# Altium project ArcadeJoystick.PrjPCB
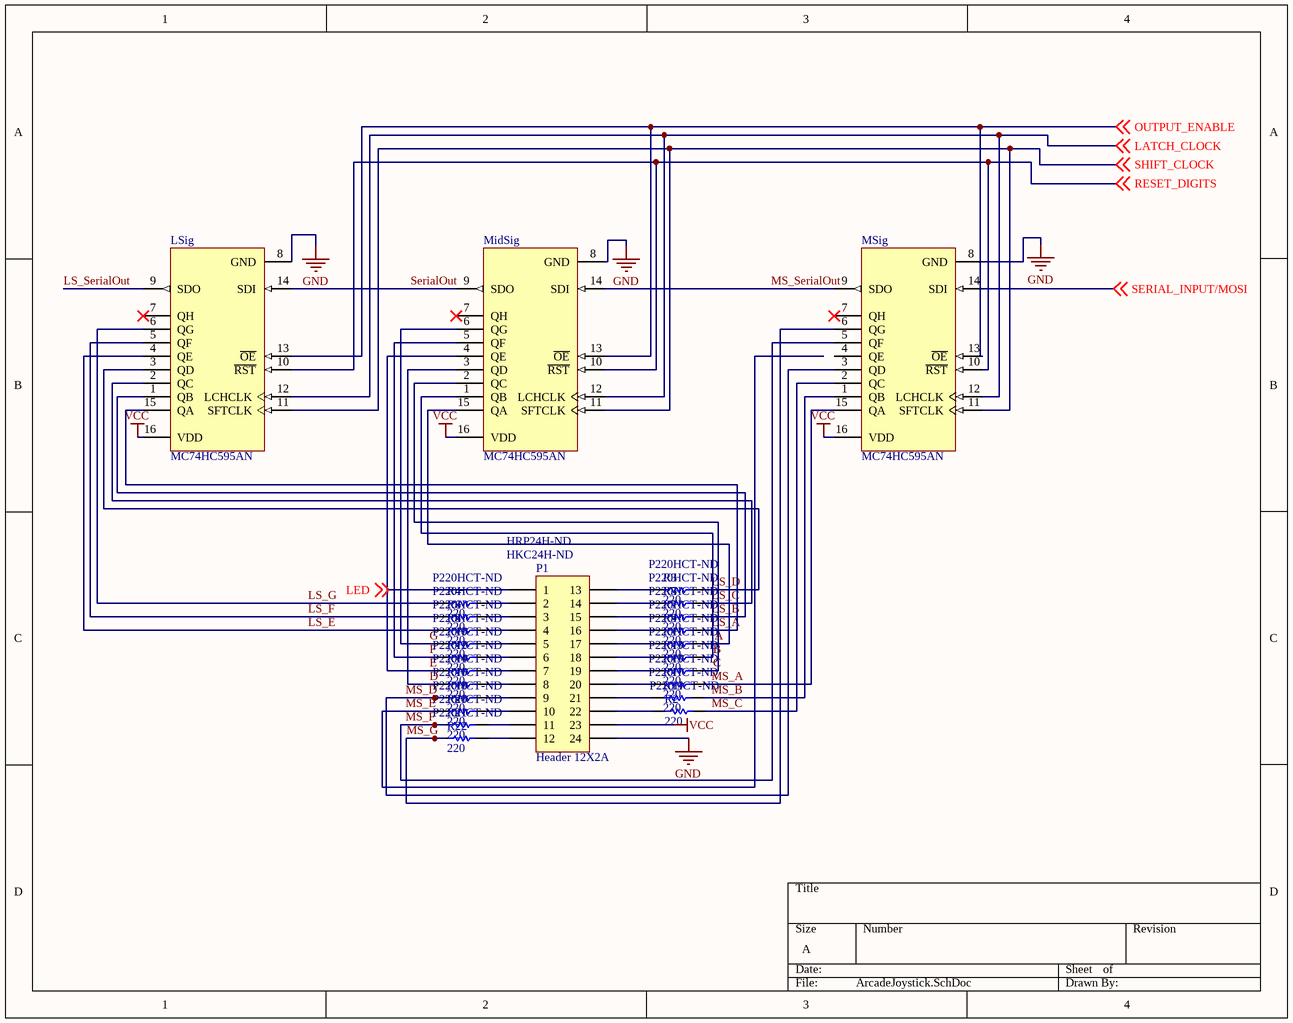
[diagram p0: ArcadeJoystick.SchDoc]
2 sheets, 52 parts. Net scope: global (net labels, ports and power ports of the same name join across sheets).
Board file: ArcadeJoystick.PcbDoc
Sheets:
  ArcadeJoystick.SchDoc
  Teensy.SchDoc

## Sheet ArcadeJoystick.SchDoc
size A

### Parts
LSig  MC74HC595AN  [648-08]
MidSig  MC74HC595AN  [648-08]
MSig  MC74HC595AN  [648-08]
P1  Header 12X2A  Supplier Part Number 1: HKC24H-ND  Supplier Part Number 2: HRP24H-ND  [HDR2X12_CEN]
R2  value 220  Supplier Part Number 1: P220HCT-ND  [1608[0603]]  (hidden comment: Res Semi)
R3  value 220  Supplier Part Number 1: P220HCT-ND  [1608[0603]]  (hidden comment: Res Semi)
R4  value 220  Supplier Part Number 1: P220HCT-ND  [1608[0603]]  (hidden comment: Res Semi)
R5  value 220  Supplier Part Number 1: P220HCT-ND  [1608[0603]]  (hidden comment: Res Semi)
R6  value 220  Supplier Part Number 1: P220HCT-ND  [1608[0603]]  (hidden comment: Res Semi)
R7  value 220  Supplier Part Number 1: P220HCT-ND  [1608[0603]]  (hidden comment: Res Semi)
R8  value 220  Supplier Part Number 1: P220HCT-ND  [1608[0603]]  (hidden comment: Res Semi)
R9  value 220  Supplier Part Number 1: P220HCT-ND  [1608[0603]]  (hidden comment: Res Semi)
R10  value 220  Supplier Part Number 1: P220HCT-ND  [1608[0603]]  (hidden comment: Res Semi)
R11  value 220  Supplier Part Number 1: P220HCT-ND  [1608[0603]]  (hidden comment: Res Semi)
R12  value 220  Supplier Part Number 1: P220HCT-ND  [1608[0603]]  (hidden comment: Res Semi)
R13  value 220  Supplier Part Number 1: P220HCT-ND  [1608[0603]]  (hidden comment: Res Semi)
R14  value 220  Supplier Part Number 1: P220HCT-ND  [1608[0603]]  (hidden comment: Res Semi)
R15  value 220  Supplier Part Number 1: P220HCT-ND  [1608[0603]]  (hidden comment: Res Semi)
R16  value 220  Supplier Part Number 1: P220HCT-ND  [1608[0603]]  (hidden comment: Res Semi)
R17  value 220  Supplier Part Number 1: P220HCT-ND  [1608[0603]]  (hidden comment: Res Semi)
R18  value 220  Supplier Part Number 1: P220HCT-ND  [1608[0603]]  (hidden comment: Res Semi)
R19  value 220  Supplier Part Number 1: P220HCT-ND  [1608[0603]]  (hidden comment: Res Semi)
R20  value 220  Supplier Part Number 1: P220HCT-ND  [1608[0603]]  (hidden comment: Res Semi)
R21  value 220  Supplier Part Number 1: P220HCT-ND  [1608[0603]]  (hidden comment: Res Semi)
R22  value 220  Supplier Part Number 1: P220HCT-ND  [1608[0603]]  (hidden comment: Res Semi)

### Nets
GND: LSig.8(GND) MidSig.8(GND) MSig.8(GND) P1.24
VCC: LSig.16(VDD) MidSig.16(VDD) MSig.16(VDD) P1.23
A: MidSig.15(QA) R11.2
B: MidSig.1(QB) R13.2
C: MidSig.2(QC) R15.2
D: MidSig.3(QD) R16.1
E: MidSig.4(QE) R14.1
F: MidSig.5(QF) R12.1
G: MidSig.6(QG) R10.1
LATCH_CLOCK: LSig.12(LCHCLK) MidSig.12(LCHCLK) MSig.12(LCHCLK) ; off-sheet LATCH_CLOCK
LED: P1.1 ; off-sheet LED
LS_A: LSig.15(QA) R9.2
LS_B: LSig.1(QB) R7.2
LS_C: LSig.2(QC) R5.2
LS_D: LSig.3(QD) R3.2
LS_E: LSig.4(QE) R8.1
LS_F: LSig.5(QF) R6.1
LS_G: LSig.6(QG) R4.1
LS_SerialOut: LSig.9(SDO)
MS_A: MSig.15(QA) R17.2
MS_B: MSig.1(QB) R19.2
MS_C: MSig.2(QC) R2.2
MS_D: MSig.3(QD) R18.1
MS_E: R20.1
MS_F: MSig.5(QF) R21.1
MS_G: MSig.6(QG) R22.1
MS_SerialOut: MidSig.14(SDI) MSig.9(SDO)
OUTPUT_ENABLE: LSig.13(~{OE}) MidSig.13(~{OE}) MSig.13(~{OE}) ; off-sheet OUTPUT_ENABLE
RESET_DIGITS: LSig.10(~{RST}) MidSig.10(~{RST}) MSig.10(~{RST}) ; off-sheet RESET_DIGITS
SERIAL_INPUT/MOSI: MSig.14(SDI) ; off-sheet SERIAL_INPUT/MOSI  [project net MOSI]
SerialOut: LSig.14(SDI) MidSig.9(SDO)
SHIFT_CLOCK: LSig.11(SFTCLK) MidSig.11(SFTCLK) MSig.11(SFTCLK) ; off-sheet SHIFT_CLOCK  [project net SCLK]
NetP1_2: P1.2 R4.2
NetP1_3: P1.3 R6.2
NetP1_4: P1.4 R8.2
NetP1_5: P1.5 R10.2
NetP1_6: P1.6 R12.2
NetP1_7: P1.7 R14.2
NetP1_8: P1.8 R16.2
NetP1_9: P1.9 R18.2
NetP1_10: P1.10 R20.2
NetP1_11: P1.11 R21.2
NetP1_12: P1.12 R22.2
NetP1_13: P1.13 R3.1
NetP1_14: P1.14 R5.1
NetP1_15: P1.15 R7.1
NetP1_16: P1.16 R9.1
NetP1_17: P1.17 R11.1
NetP1_18: P1.18 R13.1
NetP1_19: P1.19 R15.1
NetP1_20: P1.20 R17.1
NetP1_21: P1.21 R19.1
NetP1_22: P1.22 R2.1

Not connected (* = marked no-connect by the designer): LSig 7(QH)*; MidSig 7(QH)*; MSig 4(QE) 7(QH)*

### Library data of the parts
LSig MidSig MSig = MC74HC595AN: 8-Bit Serial-Input/Serial or Prallel-Output Shift Register with Latched 3-State Outputs; Published: 15-Apr-2002; DatasheetVersion: Mar-2000; PackageVersion: Apr-2000; PackageReference: 648-08; Publisher: Altium Limited; PackageDescription: DIP; 16 Leads; Row Spacing 7.62 mm; Pitch 2.54 mm; Code_JEDEC: MS-001-BB; ComponentLink1Description: Manufacturer Link; ComponentLink1URL: http://www.onsemi.com/; ComponentLink2Description: Datasheet; ComponentLink2URL: http://www.onsemi.com/pub/Collateral/MC74HC595A-D.PDF
P1 = Header 12X2A: Header, 12-Pin, Dual row; LatestRevisionDate: 17-Jul-2002; LatestRevisionNote: Re-released for DXP Platform.; Publisher: Altium Limited; Supplier 1: Digi-Key; Supplier 2: Digi-Key
R2-R22 = Res Semi: Semiconductor Resistor; Published: 8-Jun-2000; LatestRevisionDate: 17-Jul-2002; LatestRevisionNote: Re-released for DXP Platform.; PackageReference: AXIAL-0.5; Publisher: Altium Limited; PackageDescription: Axial Device, Thru-Hole; 2 Leads; 0.5 in Pin Spacing; Supplier 1: Digi-Key

## Sheet Teensy.SchDoc
size A
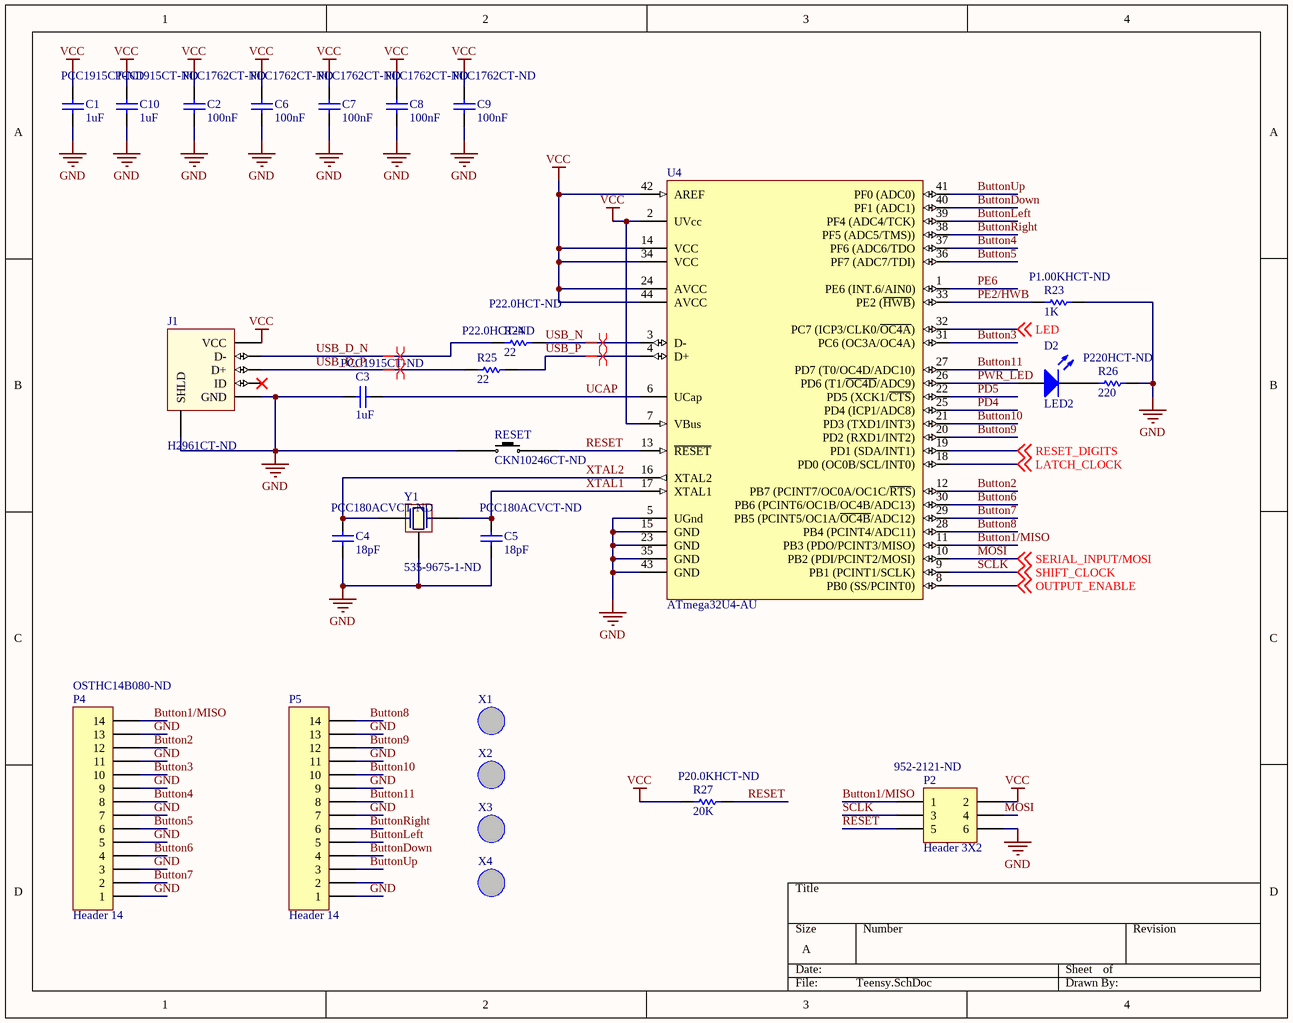
[diagram p1: Teensy.SchDoc]

### Parts
C1  value 1uF  Supplier Part Number 1: PCC1915CT-ND  [1608[0603]]  (hidden comment: Cap Semi)
C2  value 100nF  Supplier Part Number 1: PCC1762CT-ND  [1608[0603]]  (hidden comment: Cap Semi)
C3  value 1uF  Supplier Part Number 1: PCC1915CT-ND  [1608[0603]]  (hidden comment: Cap Semi)
C4  value 18pF  Supplier Part Number 1: PCC180ACVCT-ND  [1608[0603]]  (hidden comment: Cap Semi)
C5  value 18pF  Supplier Part Number 1: PCC180ACVCT-ND  [1608[0603]]  (hidden comment: Cap Semi)
C6  value 100nF  Supplier Part Number 1: PCC1762CT-ND  [1608[0603]]  (hidden comment: Cap Semi)
C7  value 100nF  Supplier Part Number 1: PCC1762CT-ND  [1608[0603]]  (hidden comment: Cap Semi)
C8  value 100nF  Supplier Part Number 1: PCC1762CT-ND  [1608[0603]]  (hidden comment: Cap Semi)
C9  value 100nF  Supplier Part Number 1: PCC1762CT-ND  [1608[0603]]  (hidden comment: Cap Semi)
C10  value 1uF  Supplier Part Number 1: PCC1915CT-ND  [1608[0603]]  (hidden comment: Cap Semi)
D2  LED2  [INDC1608L]
J1  Supplier Part Number 1: H2961CT-ND  [UX60A-MB-5ST]  (hidden comment: UX60A-MB-5ST)
P2  Header 3X2  Supplier Part Number 1: 952-2121-ND  [HDR2X3]
P4  Header 14  Supplier Part Number 1: OSTHC14B080-ND  [PTSA 0,5/14-2,5-Z]
P5  Header 14  [PTSA 0,5/14-2,5-Z]
R23  value 1K  Supplier Part Number 1: P1.00KHCT-ND  [1608[0603]]  (hidden comment: Res Semi)
R24  value 22  Supplier Part Number 1: P22.0HCT-ND  [1608[0603]]  (hidden comment: Res Semi)
R25  value 22  Supplier Part Number 1: P22.0HCT-ND  [1608[0603]]  (hidden comment: Res Semi)
R26  value 220  Supplier Part Number 1: P220HCT-ND  [1608[0603]]  (hidden comment: Res Semi)
R27  value 20K  Supplier Part Number 1: P20.0KHCT-ND  [1608[0603]]  (hidden comment: Res Semi)
RESET  Supplier Part Number 1: CKN10246CT-ND  [KMR231NGLFS]  (hidden comment: KMR231NGLFS)
U4  ATmega32U4-AU  [44ML_N]
X1  4-40 Hole  [4-40 Hole]  (value not drawn)
X2  4-40 Hole  [4-40 Hole]  (value not drawn)
X3  4-40 Hole  [4-40 Hole]  (value not drawn)
X4  4-40 Hole  [4-40 Hole]  (value not drawn)
Y1  Supplier Part Number 1: 535-9675-1-ND  [ABM8-16.000MHZ-10-1-U-T]  (hidden comment: ABM8-16.000MHZ-10-1-U-T)

### Nets
GND: C1.1 C2.2 C3.2 C4.1 C5.1 C6.2 C7.2 C8.2 C9.2 C10.1 J1.0(SHLD) J1.5(GND) P2.6 P4.1 P4.3 P4.5 P4.7 P4.9 P4.11 P4.13 P5.1 P5.7 P5.9 P5.11 P5.13 R23.2 R26.1 RESET.1 U4.5(UGnd) U4.15(GND) U4.23(GND) U4.35(GND) U4.43(GND) Y1.0(GND)
VCC: C1.2 C2.1 C6.1 C7.1 C8.1 C9.1 C10.2 J1.1(VCC) P2.2 R27.1 U4.2(UVcc) U4.7(VBus) U4.14(VCC) U4.24(AVCC) U4.34(VCC) U4.42(AREF) U4.44(AVCC)
Button1/MISO: P2.1 P4.14 U4.11(PB3_(PDO/PCINT3/MISO))
Button2: P4.12 U4.12(PB7_(PCINT7/OC0A/OC1C/~{RTS}))
Button3: P4.10 U4.31(PC6_(OC3A/OC4A))
Button4: P4.8 U4.37(PF6_(ADC6/TDO)
Button5: P4.6 U4.36(PF7_(ADC7/TDI))
Button6: P4.4 U4.30(PB6_(PCINT6/OC1B/OC4B/ADC13))
Button7: P4.2 U4.29(PB5_(PCINT5/OC1A/~{OC4B}/ADC12))
Button8: P5.14 U4.28(PB4_(PCINT4/ADC11))
Button9: P5.12 U4.20(PD2_(RXD1/INT2))
Button10: P5.10 U4.21(PD3_(TXD1/INT3))
Button11: P5.8 U4.27(PD7_(T0/OC4D/ADC10))
ButtonDown: P5.4 U4.40(PF1_(ADC1))
ButtonLeft: P5.5 U4.39(PF4_(ADC4/TCK))
ButtonRight: P5.6 U4.38(PF5_(ADC5/TMS)))
ButtonUp: P5.3 U4.41(PF0_(ADC0))
LATCH_CLOCK: U4.18(PD0_(OC0B/SCL/INT0)) ; off-sheet LATCH_CLOCK
LED: U4.32(PC7_(ICP3/CLK0/~{OC4A})) ; off-sheet LED
MOSI: P2.4 U4.10(PB2_(PDI/PCINT2/MOSI)) ; off-sheet SERIAL_INPUT/MOSI  [also labelled SERIAL_INPUT/MOSI]
OUTPUT_ENABLE: U4.8(PB0_(SS/PCINT0)) ; off-sheet OUTPUT_ENABLE
PD4: U4.25(PD4_(ICP1/ADC8))
PD5: U4.22(PD5_(XCK1/~{CTS}))
PE2/HWB: R23.1 U4.33(PE2_(~{HWB}))
PE6: U4.1(PE6_(INT.6/AIN0))
PWR_LED: D2.1(A) U4.26(PD6_(T1/~{OC4D}/ADC9))
RESET: P2.5 R27.2 RESET.2 U4.13(~{RESET})
RESET_DIGITS: U4.19(PD1_(SDA/INT1)) ; off-sheet RESET_DIGITS
SCLK: P2.3 U4.9(PB1_(PCINT1/SCLK)) ; off-sheet SHIFT_CLOCK  [also labelled SHIFT_CLOCK]
UCAP: C3.1 U4.6(UCap)
USB_D_N: J1.2(D-) R24.1
USB_D_P: J1.3(D+) R25.1
USB_N: R24.2 U4.3(D-)
USB_P: R25.2 U4.4(D+)
XTAL1: C5.2 U4.17(XTAL1) Y1.4
XTAL2: C4.2 U4.16(XTAL2) Y1.2
NetD2_2: D2.2(K) R26.2

Not connected (* = marked no-connect by the designer): J1 4(ID)*; P5 2

### Layout directives
differential pair: USB_D_N, USB_D_P, USB_N, USB_P

### Library data of the parts
C1-C10 = Cap Semi: Capacitor (Semiconductor SIM Model); Published: 8-Jun-2000; LatestRevisionDate: 29-May-2009; LatestRevisionNote: IPC-7351 Footprint Added.; PackageReference: C1206; Publisher: Altium Limited; PackageDescription: Chip Capacitor; Supplier 1: Digi-Key
D2 = LED2: 475-2816-1-ND; Published: 8-Jun-2000; LatestRevisionDate: 17-Jul-2002; LatestRevisionNote: Re-released for DXP Platform.; PackageVersion: Feb-2002; PackageReference: 3.2X1.6X1.1; Publisher: Altium Limited; PackageDescription: SM LED; 2 Flat Leads; Supplier 1: Digi-Key; Supplier Part Number 1: 475-2816-1-ND
J1 = UX60A-MB-5ST: USBMiniBSocket Metal Shield SMT Type Without Positioning Post; Supplier 1: Digi-Key
P2 = Header 3X2: Header, 3-Pin, Dual row; LatestRevisionDate: 17-Jul-2002; LatestRevisionNote: Re-released for DXP Platform.; Publisher: Altium Limited; Supplier 1: Digi-Key
P4 P5 = Header 14: Header, 14-Pin; LatestRevisionDate: 17-Jul-2002; LatestRevisionNote: Re-released for DXP Platform.; Publisher: Altium Limited
  P4: Supplier 1: Digi-Key
R23-R27 = Res Semi: Semiconductor Resistor; Published: 8-Jun-2000; LatestRevisionDate: 17-Jul-2002; LatestRevisionNote: Re-released for DXP Platform.; PackageReference: AXIAL-0.5; Publisher: Altium Limited; PackageDescription: Axial Device, Thru-Hole; 2 Leads; 0.5 in Pin Spacing; Supplier 1: Digi-Key
RESET = KMR231NGLFS: KMR 2 Series  Microminiature SMT Top Actuated; Supplier 1: Digi-Key
U4 = ATmega32U4-AU: 8-bit AVR Microcontroller, 2.7-5.5V, 32KB Flash, 2.5KB EEPROM, 1KB SRAM, USB Controller, 44-pin TQFP, Industrial Grade (-40°C to 85°C); Published: 1-Apr-2010; DatasheetVersion: revD, Jan-2009; PackageVersion: rev.G, Jul-2007; PackageReference: 44ML; Publisher: Altium Limited; PackageDescription: 44-Pin Plastic Thin Quad Flat Pack, 10 x 10 x 1.0 mm Body, 0.8 mm Pitch (TQFP); Supplier 1: Digi-Key; Supplier Part Number 1: ATMEGA32U4-AU-ND; Supplier 2: Farnell; Supplier Part Number 2: 1748525; Supplier 3: Mouser; Supplier Part Number 3: 556-ATMEGA32U4-AU; ComponentLink1Description: Manufacturer Link; ComponentLink1URL: http://www.atmel.com/products/avr/default.asp?; ComponentLink2Description: ATmega16U4/32U4 Datasheet; ComponentLink2URL: http://www.atmel.com/dyn/resources/prod_documents/doc7766.pdf; ComponentLink3Description: ATmega16U4 ATmega32U4 Summary; ComponentLink3URL: http://www.atmel.com/dyn/resources/prod_documents/7766S.pdf; ComponentLink4Description: Atmel.com Home; ComponentLink4URL: http://www.atmel.com
Y1 = ABM8-16.000MHZ-10-1-U-T: Crystal Resonator; Supplier 1: Digi-Key

## Nets that join several sheets
GND: ArcadeJoystick (LSig.8 MidSig.8 MSig.8 P1.24), Teensy (34 pins)
VCC: ArcadeJoystick (LSig.16 MidSig.16 MSig.16 P1.23), Teensy (17 pins)
LATCH_CLOCK: ArcadeJoystick (LSig.12 MidSig.12 MSig.12), Teensy (U4.18)
LED: ArcadeJoystick (P1.1), Teensy (U4.32)
MOSI: ArcadeJoystick (MSig.14), Teensy (P2.4 U4.10)
OUTPUT_ENABLE: ArcadeJoystick (LSig.13 MidSig.13 MSig.13), Teensy (U4.8)
RESET_DIGITS: ArcadeJoystick (LSig.10 MidSig.10 MSig.10), Teensy (U4.19)
SCLK: ArcadeJoystick (LSig.11 MidSig.11 MSig.11), Teensy (P2.3 U4.9)